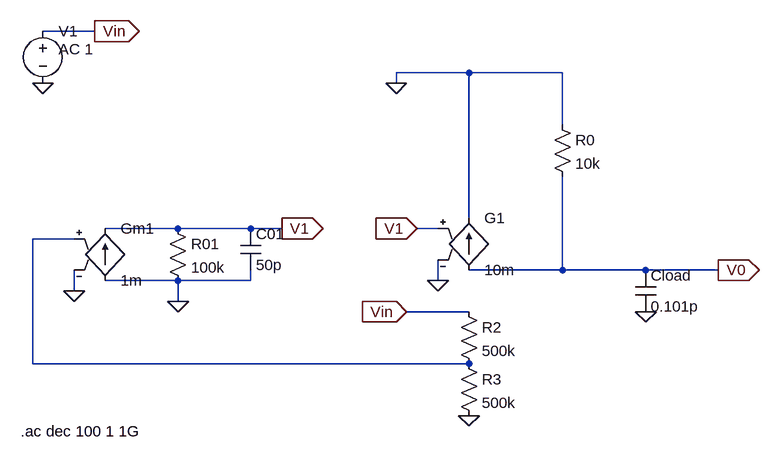
[diagram p0: schematic linreg.asc]
linreg.asc, the LTspice schematic file:
Version 4
SHEET 1 880 680
WIRE -432 -208 -512 -208
WIRE 144 -144 32 -144
WIRE 288 -144 144 -144
WIRE 32 -128 32 -144
WIRE 288 -64 288 -144
WIRE 144 80 144 -144
WIRE -304 96 -416 96
WIRE -192 96 -304 96
WIRE -144 96 -192 96
WIRE 96 96 64 96
WIRE -464 112 -528 112
WIRE 288 160 288 16
WIRE 288 160 144 160
WIRE 416 160 288 160
WIRE 528 160 416 160
WIRE -304 176 -416 176
WIRE -192 176 -192 160
WIRE -192 176 -304 176
WIRE 96 176 96 144
WIRE -464 192 -464 160
WIRE -304 208 -304 176
WIRE 144 224 48 224
WIRE -528 304 -528 112
WIRE 144 304 -528 304
FLAG -144 96 V1
IOPIN -144 96 Out
FLAG 64 96 V1
IOPIN 64 96 In
FLAG 96 176 0
FLAG 144 384 0
FLAG -464 192 0
FLAG 416 224 0
FLAG 528 160 V0
IOPIN 528 160 Out
FLAG 32 -128 0
FLAG 48 224 Vin
IOPIN 48 224 In
FLAG -432 -208 Vin
IOPIN -432 -208 Out
FLAG -512 -128 0
FLAG -304 208 0
SYMBOL g -416 80 R0
SYMATTR InstName Gm1
SYMATTR Value 1m
SYMBOL res -320 80 R0
SYMATTR InstName R01
SYMATTR Value 100k
SYMBOL cap -208 96 R0
SYMATTR InstName C01
SYMATTR Value 50p
SYMBOL g 144 64 R0
SYMATTR InstName G1
SYMATTR Value 10m
SYMBOL res 272 -80 R0
SYMATTR InstName R0
SYMATTR Value 10k
SYMBOL res 128 208 R0
SYMATTR InstName R2
SYMATTR Value 500k
SYMBOL res 128 288 R0
SYMATTR InstName R3
SYMATTR Value 500k
SYMBOL cap 400 160 R0
SYMATTR InstName Cload
SYMATTR Value 0.101p
SYMBOL voltage -512 -224 R0
WINDOW 123 24 44 Left 2
WINDOW 39 0 0 Left 0
SYMATTR InstName V1
SYMATTR Value ""
SYMATTR Value2 AC 1
TEXT -546 408 Left 2 !.ac dec 100 1 1G

The netlist it stands for:
* linreg.asc
Gm1 0 V1 N001 0 1m
R01 V1 0 100k
C01 V1 0 50p
G1 V0 0 V1 0 10m
R0 0 V0 10k
R2 Vin N001 500k
R3 N001 0 500k
Cload V0 0 0.101p
V1 Vin 0 AC 1
.ac dec 100 1 1G
.backanno
.end